# EAGLE design LRT_SHOCK_V1 (EAGLE 9.6.2)
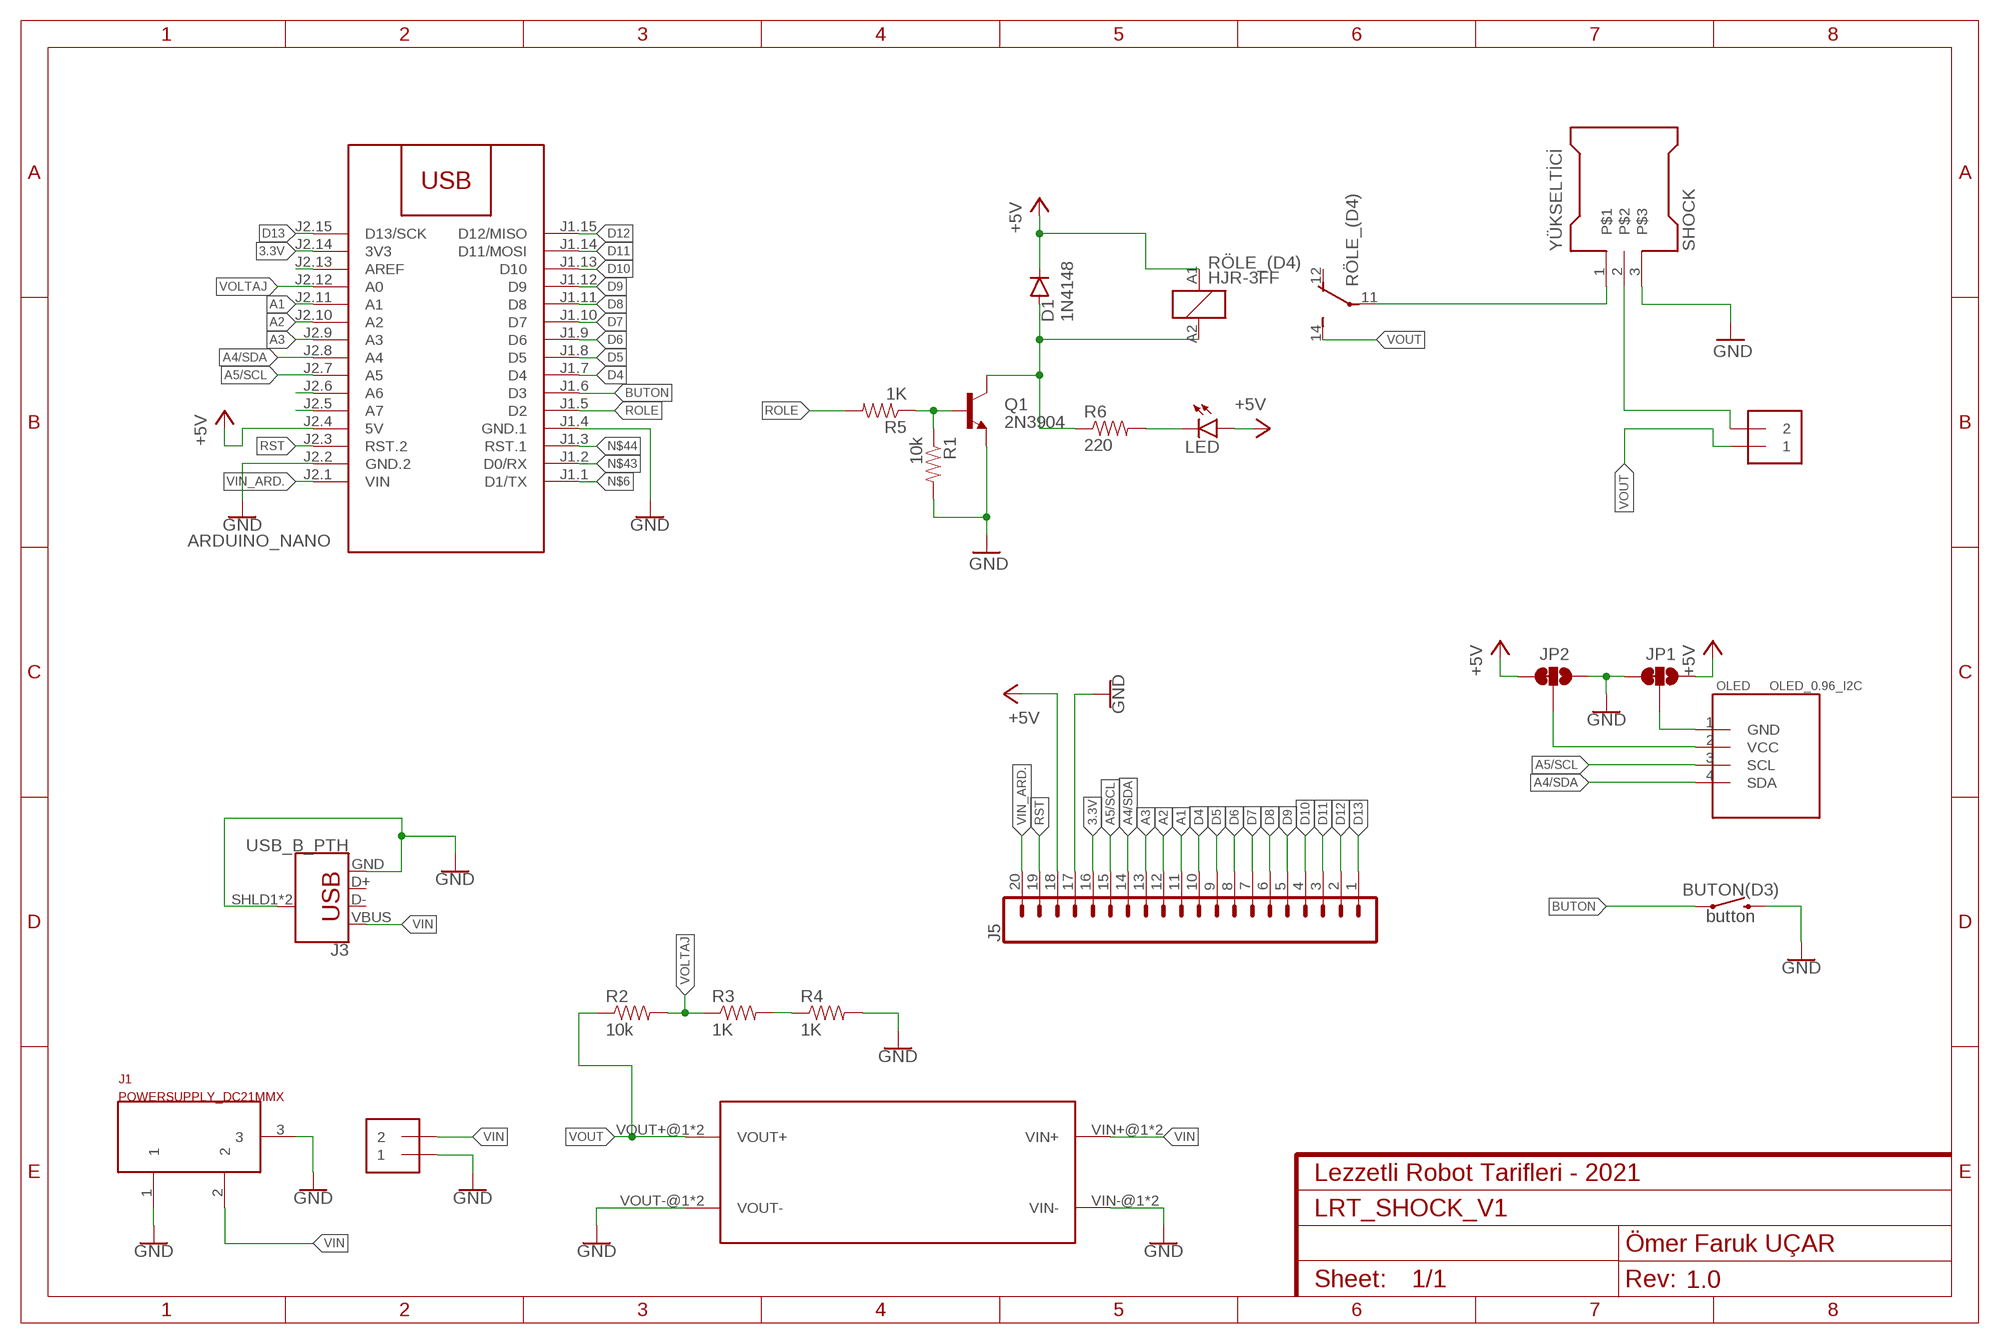
[diagram p0: schematic, sheet 1]
FRAME1 (FRAME-A4L): CNAME: Lezzetli Robot Tarifleri - 2021; CREVISION: 1.0; DESIGNER: Ömer Faruk UÇAR

## Parts
ARDUINO_NANO  ARDUINO-NANO  [ARDUINO-NANO]
BUTON(D3)  button  MOMENTARY-SWITCH-SPST-PTH-12MM  [TACTILE_SWITCH_PTH_12MM]
D1  1N4148  DIODEKIT  [DIODE-1N4148-KIT]
J1  POWERSUPPLY_DC21MMX  [POWERSUPPLY_DC-21MM]
J2  1X2-3.5MM  [1X2-3.5MM]
J3  USB_B_PTH  [USB-B-PTH]
J5  CONN_20  [1X20]
JP1  JUMPER-SMT_3_1-NC_TRACE_SILK  [SMT-JUMPER_3_1-NC_TRACE_SILK]
JP2  JUMPER-SMT_3_1-NC_TRACE_SILK  [SMT-JUMPER_3_1-NC_TRACE_SILK]
LED  LED5MM-KIT  [LED5MM-KIT]
MT3608  MT3608MT3608_2  [MT3608_2]
OLED  OLED_0.96_I2C  [OLED_0.96_I2C]
Q1  2N3904  TRANSISTOR_NPN2N3904-EZ  [TO-92-EZ]
R1  10k  1KOHM-1/4W-1%(PTH)HORIZ-KIT  [AXIAL-0.3EZ]
R2  10k  1KOHM-1/4W-1%(PTH)HORIZ-KIT  [AXIAL-0.3EZ]
R3  1K  1KOHM-1/4W-1%(PTH)HORIZ-KIT  [AXIAL-0.3EZ]
R4  1K  1KOHM-1/4W-1%(PTH)HORIZ-KIT  [AXIAL-0.3EZ]
R5  1K  1KOHM-1/4W-1%(PTH)HORIZ-KIT  [AXIAL-0.3EZ]
R6  220  1KOHM-1/4W-1%(PTH)HORIZ-KIT  [AXIAL-0.3EZ]
RÖLE_(D4)  HJR-3FF  ZNS5106  [ZN5]
SHOCK!!  1X2-3.5MM  [1X2-3.5MM]
YÜKSELTİCİ  SHOCK  [SHOCK]

## Nets
3.3V: ARDUINO_NANO.J2.14(3V3) J5.16
+5V: ARDUINO_NANO.J2.4(5V) D1.C J5.18 JP1.1 JP2.3 LED.A RÖLE_(D4).A1
A1: ARDUINO_NANO.J2.11(A1) J5.11
A2: ARDUINO_NANO.J2.10(A2) J5.12
A3: ARDUINO_NANO.J2.9(A3) J5.13
A4/SDA: ARDUINO_NANO.J2.8(A4) J5.14 OLED.4(SDA)
A5/SCL: ARDUINO_NANO.J2.7(A5) J5.15 OLED.3(SCL)
BUTON: ARDUINO_NANO.J1.6(D3) BUTON(D3).1
D4: ARDUINO_NANO.J1.7(D4) J5.10
D5: ARDUINO_NANO.J1.8(D5) J5.9
D6: ARDUINO_NANO.J1.9(D6) J5.8
D7: ARDUINO_NANO.J1.10(D7) J5.7
D8: ARDUINO_NANO.J1.11(D8) J5.6
D9: ARDUINO_NANO.J1.12(D9) J5.5
D10: ARDUINO_NANO.J1.13(D10) J5.4
D11: ARDUINO_NANO.J1.14(D11/MOSI) J5.3
D12: ARDUINO_NANO.J1.15(D12/MISO) J5.2
D13: ARDUINO_NANO.J2.15(D13/SCK) J5.1
GND: ARDUINO_NANO.J1.4(GND.1) ARDUINO_NANO.J2.2(GND.2) BUTON(D3).3 J1.1 J1.3 J2.1 J3.GND J3.SHLD1(SHIELD) J3.SHLD2(SHIELD) J5.17 JP1.3 JP2.1 MT3608.VIN-@1(VIN-) MT3608.VIN-@2(VIN-) Q1.1(E) R1.P$2 R4.P$2 YÜKSELTİCİ.3
N$1: MT3608.VOUT-@1(VOUT-) MT3608.VOUT-@2(VOUT-) ; supply symbol labelled GND
N$3: SHOCK!!.2 YÜKSELTİCİ.2
N$5: R3.P$2 R4.P$1
N$6: ARDUINO_NANO.J1.1(D1/TX)
N$10: JP1.2 OLED.1(GND)
N$14: D1.A Q1.3(C) R6.P$1 RÖLE_(D4).A2
N$15: Q1.2(B) R1.P$1 R5.P$1
N$17: LED.K(C) R6.P$2
N$18: RÖLE_(D4).11(2:P) YÜKSELTİCİ.1
N$19: JP2.2 OLED.2(VCC)
N$36: ARDUINO_NANO.J2.13(AREF)
N$40: ARDUINO_NANO.J2.6(A6)
N$41: ARDUINO_NANO.J2.5(A7)
N$43: ARDUINO_NANO.J1.2(D0/RX)
N$44: ARDUINO_NANO.J1.3(RST.1)
ROLE: ARDUINO_NANO.J1.5(D2) R5.P$2
RST: ARDUINO_NANO.J2.3(RST.2) J5.19
VIN: J1.2 J2.2 J3.VBUS MT3608.VIN+@1(VIN+) MT3608.VIN+@2(VIN+)
VIN_ARD.: ARDUINO_NANO.J2.1(VIN) J5.20
VOLTAJ: ARDUINO_NANO.J2.12(A0) R2.P$2 R3.P$1
VOUT: MT3608.VOUT+@1(VOUT+) MT3608.VOUT+@2(VOUT+) R2.P$1 RÖLE_(D4).14(2:S) SHOCK!!.1
Unconnected: J3.D+ J3.D- RÖLE_(D4).12(2:O)

## Library data of the parts
ARDUINO_NANO = OmerFaruk-CPUBoards:ARDUINO-NANO: Arduino Nano 3.0
BUTON(D3) = SparkFun-Switches:MOMENTARY-SWITCH-SPST: Momentary Switch (Pushbutton) - SPST Normally-open (NO) SPST momentary switches (buttons, pushbuttons). Variants PTH-12MM - 12mm square, through-hole Momentary Pushbutton Switch - 12mm Square <https://www.sparkfun.com/products/9190> (COM-09190) PTH-6.0MM, PTH-6.0MM-KIT - 6.0mm square, through-hole Mini Pushbutton Switch <https://www.sparkfun.com/products/97> (COM-00097) KIT package intended for soldering kit's - only one side of pads' copper is exposed. PTH-RIGHT-ANGLE-KIT - Right-angle, through-hole Right Angle Tactile Button <https://www.sparkfun.com/products/10791> - Used on SparkFun BigTime Watch Kit <https://www.sparkfun.com/products/11734> SMD-12MM - 12mm square, surface-mount Tactile Button - SMD (12mm) <https://www.sparkfun.com/products/12993> (COM-12993) Used on SparkFun PicoBoard <https://www.sparkfun.com/products/11888> SMD-4.5MM - 4.5mm Square Trackball Switch Used on SparkFun Blackberry Trackballer Breakout <https://www.sparkfun.com/products/13169> SMD-4.6MMX2.8MM - 4.60mm x 2.80mm, surface mount Used on SparkFun SAMD21 Mini Breakout <https://www.sparkfun.com/products/13664> SMD-5.2MM, SMD-5.2-REDUNDANT - 5.2mm square, surface-mount Mini Pushbutton Switch - SMD <https://www.sparkfun.com/products/8720> (COM-08720) Used on Arduino Pro Mini <https://www.sparkfun.com/products/11114> REDUNDANT package connects both switch circuits together SMD-6.0X3.5MM - 6.0 x 3.5mm, surface mount Momentary Reset Switch SMD <https://www.sparkfun.com/products/8229> (COM-08229) SMD-6.2MM-TALL - 6.2mm square, surface mount Tactile Button - SMD (6mm) <https://www.sparkfun.com/products/12992> Used on SparkFun Digital Sandbox <https://www.sparkfun.com/products/12651> SMD-RIGHT-ANGLE - Right-angle, surface mount Used on SparkFun Block for Intel® Edison - Arduino <https://www.sparkfun.com/products/13036>; PROD_ID: SWCH-09185; SF_SKU: COM-09190
D1 = SparkFun-DiscreteSemi:DIODE: Diode These are standard reverse protection diodes and small signal diodes. SMA package can handle up to about 1A. SOD-323 can handle about 200mA. What the SOD-323 package when ordering, there are some mfgs out there that are 5-pin packages.; PROD_ID: DIO-08378
J1 = SmartPrj:POWERSUPPLY_DC21MM
J2 SHOCK!! = adafruit:1X2: 3.5mm Terminal block http://www.ladyada.net/library/pcb/eaglelibrary.html
J3 = SparkFun-Connectors:USB_B: USB Type B Connector SparkFun Products: SparkFun Stepoko <https://www.sparkfun.com/products/13899> PTH; PROD_ID: CONN-08278; SF_ID: PRT-00139
J5 = SparkFun-Connectors:CONN_20: Multi connection point. Often used as Generic Header-pin footprint for 0.1 inch spaced/style header connections On any of the 0.1 inch spaced packages, you can populate with these: Break Away Headers - Straight <https://www.sparkfun.com/products/116> (PRT-00116) Break Away Male Headers - Right Angle <https://www.sparkfun.com/products/553> (PRT-00553) Female Headers <https://www.sparkfun.com/products/115> (PRT-00115) Break Away Headers - Machine Pin <https://www.sparkfun.com/products/117> (PRT-00117) Break Away Female Headers - Swiss Machine Pin <https://www.sparkfun.com/products/743> (PRT-00743) For SCREWTERMINALS and SPRING TERMINALS visit here: Screw Terimnals on SparkFun.com <https://www.sparkfun.com/search/results?term=Screw+Terminals> (5mm/3.5mm/2.54mm spacing) This device is also useful as a general connection point to wire up your design to another part of your project. Our various solder wires solder well into these plated through hole pads. Hook-Up Wire - Assortment (Stranded, 22 AWG) <https://www.sparkfun.com/products/11375> (PRT-11375) Hook-Up Wire - Assortment (Solid Core, 22 AWG) <https://www.sparkfun.com/products/11367> (PRT-11367) View the entire wire category on our website here <https://www.sparkfun.com/categories/141> Special notes: Molex polarized connector foot print use with SKU : PRT-08231 with associated crimp pins and housings. 1MM SMD Version SKU: PRT-10208 NOTES ON THE VARIANTS LOCK and LOCK_LONGPADS... This footprint was designed to help hold the alignment of a through-hole component (i.e. 6-pin header) while soldering it into place. You may notice that each hole has been shifted either up or down by 0.005 of an inch from it's more standard position (which is a perfectly straight line). This slight alteration caused the pins (the squares in the middle) to touch the edges of the holes. Because they are alternating, it causes a "brace" to hold the component in place. 0.005 has proven to be the perfect amount of "off-center" position when using our standard breakaway headers. Although looks a little odd when you look at the bare footprint, once you have a header in there, the alteration is very hard to notice. Also,if you push a header all the way into place, it is covered up entirely on the bottom side. Note about LOCK SPECIAL package: This is just like the LOCK variant in that the holes are staggared by 5 mil, but except for the last two holes. They are not altered from the "standard" footprint layout. This is used for a special purpose on the layout of our Graphic LCD Backpack. Make sure you want to use this device before selecting it for you project!
JP1 JP2 = SparkFun-Jumpers:JUMPER-SMT_3_1-NC_TRACE: Normally closed trace jumper (1 of 2 connections) This jumper has a trace between two pads so it's normally closed (NC). The other connection is normally open (NO). Use a razor knife to open the connection. For best results follow the IPC guidelines for cutting traces: Cutout at least 0.063 mm (0.005 in). Remove all loose material to clean up the cut area. Seal the cut with an approved epoxy. Reapply solder to reclose the connection, or to close the NO connection.
LED = SparkFun-LED:LED: LEDs Standard schematic elements and footprints for 5mm, 3mm, 1206, and 0603 sized LEDs. 5mm - Spark Fun Electronics SKU : COM-00529 (and others); PROD_ID: DIO-09529
MT3608 = OmerFarukUcar-PowerModules:MT3608
OLED = tft_1.8_1.44_oled_0.96:OLED_0.96_I2C
Q1 = SparkFun-DiscreteSemi:TRANSISTOR_NPN: Generic NPN BJT MMBT2222A - TRANS-08049 (SOT-23, 1A 40V) MPSA42 - TRANS-09116 (SOT-23, 500mA 300V) MMBT5088LT1G - TRANS-11160 (SOT-23, 50 mA 30V) BC547 - COM-08928 <http://www.sparkfun.com/products/8928> (TO-92 45V 100mA) (1.Collector 2.Base 3.Emitter) 2N3904 - COM-00521 <http://www.sparkfun.com/products/521> (TO-92 40V 200mA) (1.Emitter 2.Base 3.Collector) P2N2222A - COM-12852 <http://www.sparkfun.com/products/12852> (TO-92 40V 600mA) (1.Collector 2.Base 3.Emitter); PROD_ID: TRANS-08447
R1 R2 R6 = SparkFun-Resistors:1KOHM-1/4W-1%(PTH): RES-12182; PROD_ID: RES-12182; VALUE: 1K
R3-R5 = SparkFun-Resistors:1KOHM-1/4W-1%(PTH): RES-12182; PROD_ID: RES-12182
RÖLE_(D4) = relay:ZNS5*: Miniature Power PCB Relay SCHRACK 1pole 10 A Source: http://www.schrack.com/.. 5847.pdf; OC_FARNELL: unknown; OC_NEWARK: unknown
YÜKSELTİCİ = OmerFarukUcar-Test:SHOCK

## Board
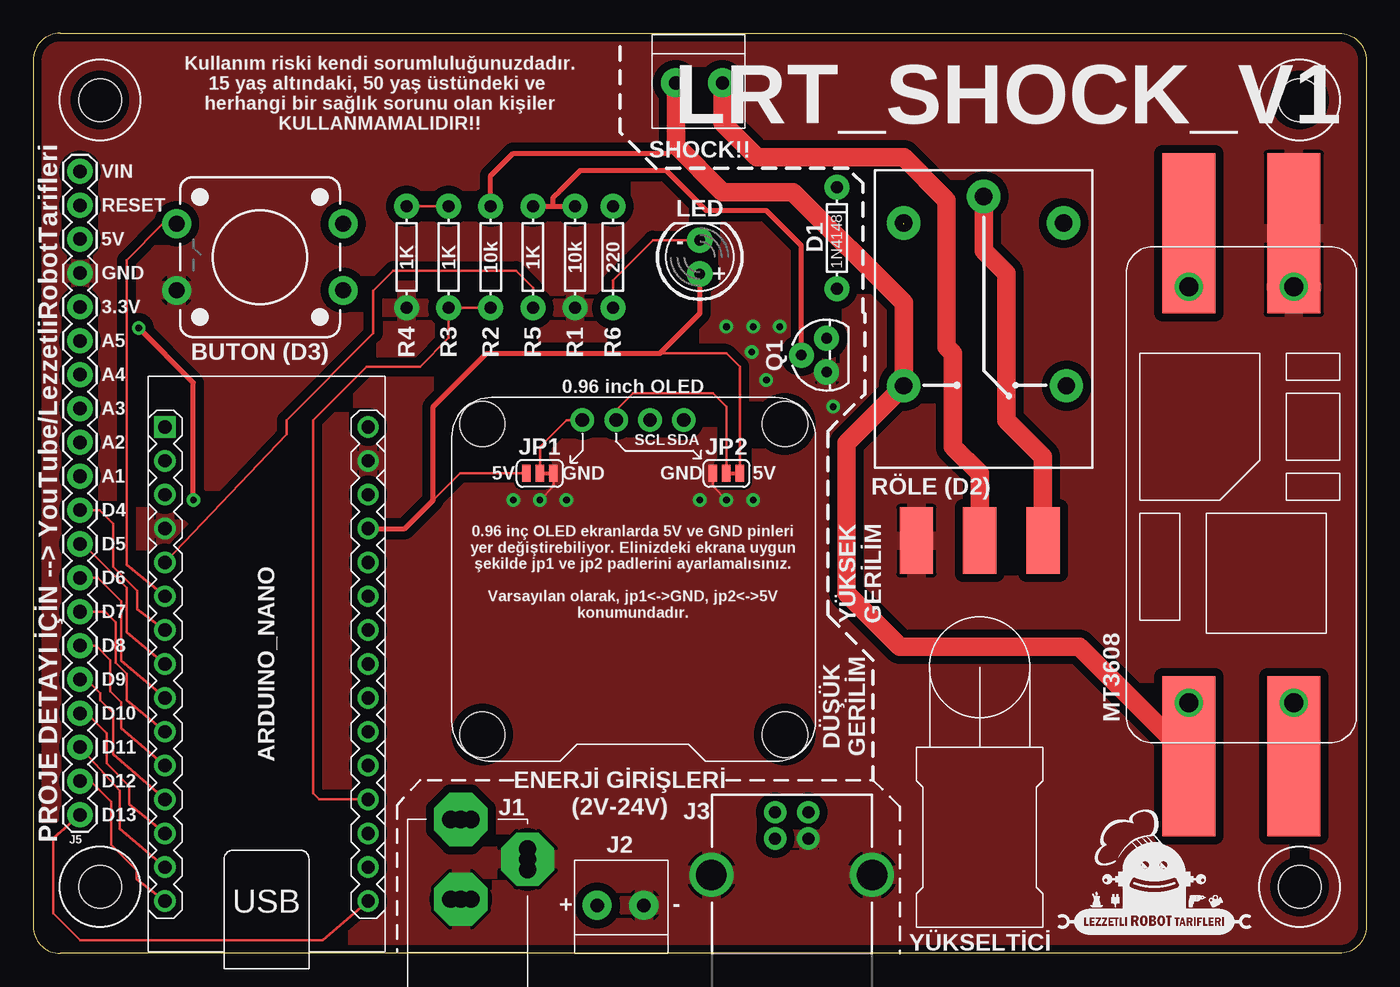
[diagram p1: board, top side]
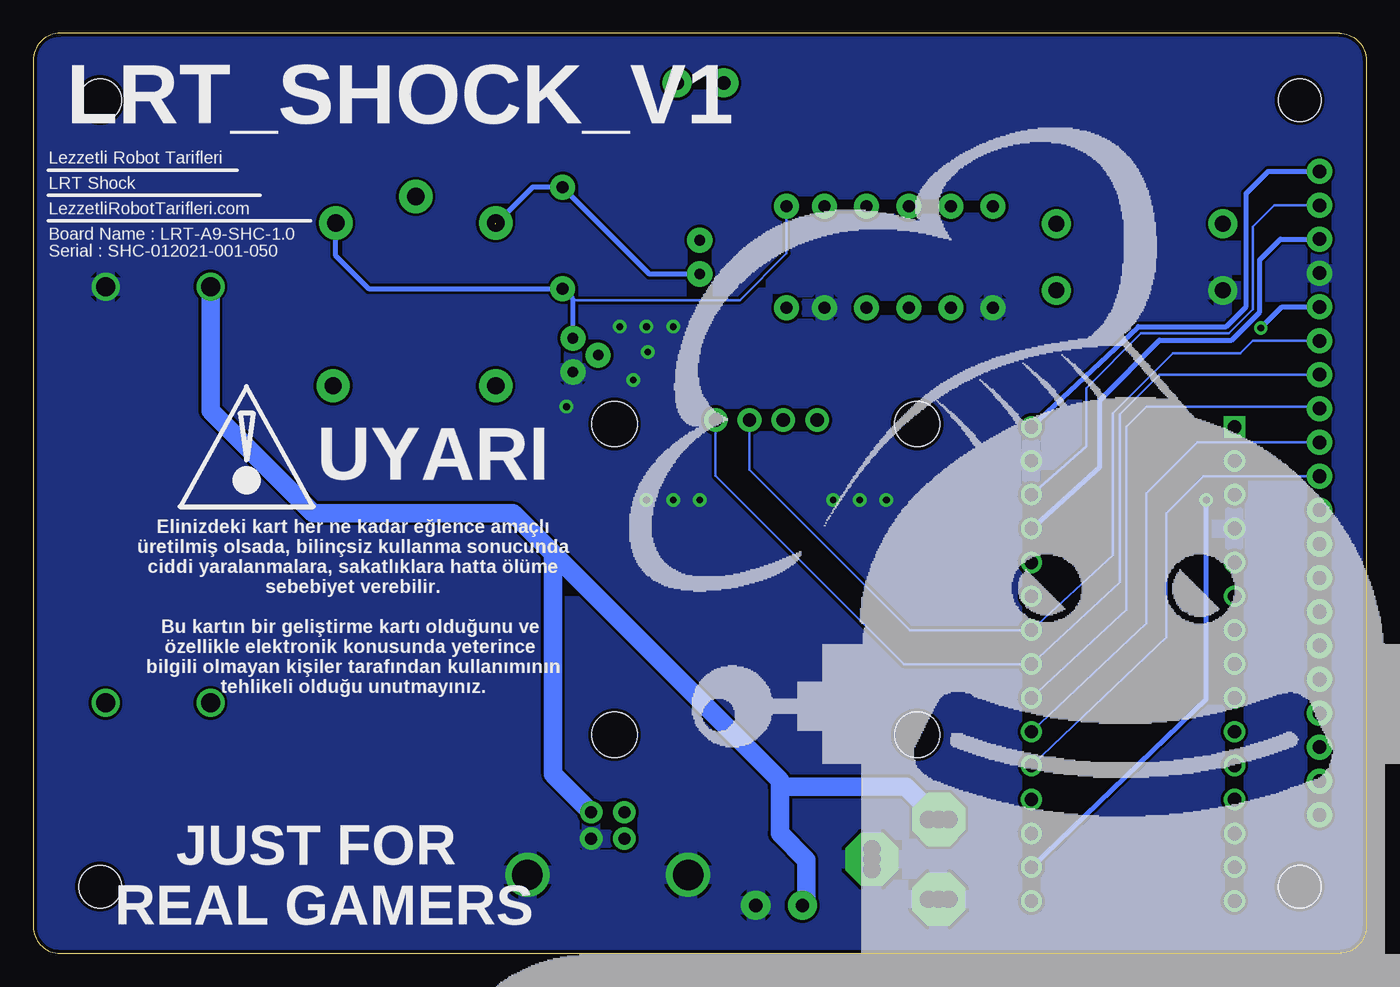
[diagram p2: board, bottom side, seen from below]

Size 100 x 69 mm. Coordinates in mm from the lower left corner, seen from the top.
Outline: 0,67 0,2 arc90 2,0 98,0 arc90 100,2 100,67 arc90 98,69 2,69 arc90 0,67
Copper layers (1*16): Top 0.035mm / dielectric 1.5mm / Bottom 0.035mm
Design rules "SparkFunOFU": minimum track width 8mil, minimum drill 12mil, track to track 8mil, track to pad 8mil, pad to pad 8mil, via to via 8mil, smd to smd 0mil, copper to edge 10mil, drill to drill 10mil, minimum pad ring 12mil, minimum via ring 10mil, stop-mask expansion 2mil, vias tented up to drill 100mil, thermal gap 10mil
Holes 3.2 mm at 5,5 5,64 95,64 95,5

### Footprints (pad centres in the part's own frame; a part is rotated, then mirrored left to right if it is on the bottom)
ARDUINO-NANO = drill 1 square: J1.1 17.78,7.62 | drill 1: J1.2 15.24,7.62; J1.3 12.7,7.62; J1.4 10.16,7.62; J1.5 7.62,7.62; J1.6 5.08,7.62; J1.7 2.54,7.62; J1.8 0,7.62; J1.9 -2.54,7.62; J1.10 -5.08,7.62; J1.11 -7.62,7.62; J1.12 -10.16,7.62; J1.13 -12.7,7.62; J1.14 -15.24,7.62; J1.15 -17.78,7.62; J2.1 17.78,-7.62; J2.2 15.24,-7.62; J2.3 12.7,-7.62; J2.4 10.16,-7.62; J2.5 7.62,-7.62; J2.6 5.08,-7.62; J2.7 2.54,-7.62; J2.8 0,-7.62; J2.9 -2.54,-7.62; J2.10 -5.08,-7.62; J2.11 -7.62,-7.62; J2.12 -10.16,-7.62; J2.13 -12.7,-7.62; J2.14 -15.24,-7.62; J2.15 -17.78,-7.62
TACTILE_SWITCH_PTH_12MM = drill 1.2 pad 2.159: 1 6.25,-2.5; 2 -6.25,-2.5; 3 6.25,2.5; 4 -6.25,2.5
DIODE-1N4148-KIT = drill 0.9 pad 1.88: A -3.81,0; C 3.81,0
POWERSUPPLY_DC-21MM = drill 1.3 pad 4 octagon: 1 -5.08,-3.353; 2 -0.076,-6.35; 3 -0.076,-0.356 | drill 1.3: 4 -5.08,-4.115; 5 -5.08,-2.591; 6 -0.838,-0.356; 7 0.686,-0.356; 8 -0.838,-6.35; 9 0.686,-6.35
1X2-3.5MM = drill 1 pad 2.184: 1 1.8,0; 2 -1.7,0
USB-B-PTH = drill 0.914 pad 1.676: D+ 4,1.25; D- 5.981,1.25; GND 4,-1.25; VBUS 5.981,-1.25 | drill 2.286: SHLD1 1.282,-6.02; SHLD2 1.282,6.02
1X20 = drill 1.016 pad 1.88: 1 0,0; 2 2.54,0; 3 5.08,0; 4 7.62,0; 5 10.16,0; 6 12.7,0; 7 15.24,0; 8 17.78,0; 9 20.32,0; 10 22.86,0; 11 25.4,0; 12 27.94,0; 13 30.48,0; 14 33.02,0; 15 35.56,0; 16 38.1,0; 17 40.64,0; 18 43.18,0; 19 45.72,0; 20 48.26,0
SMT-JUMPER_3_1-NC_TRACE_SILK = smd 0.635 x 1.27: 1 -1.016,0; 2 0,0; 3 1.016,0
LED5MM-KIT = drill 0.813 pad 1.88: A -1.27,0; K 1.27,0
MT3608_2 = drill 1.4: VIN+@1 -16,-4.301; VIN-@1 -16,3.573; VOUT+@1 15.211,-4.301; VOUT-@1 15.211,3.573 | smd 12 x 4: VIN+@2 -20,-4.301; VIN-@2 -20,3.573; VOUT+@2 19.211,-4.301; VOUT-@2 19.211,3.573
OLED_0.96_I2C = drill 1 pad 1.778: 1 -3.81,12; 2 -1.27,12; 3 1.27,12; 4 3.81,12 | hole 3.4: -11.31,-11.6; 11.39,-11.6; 11.39,11.7; -11.31,11.7
TO-92-EZ = drill 0.813 pad 1.88: 1 -1.27,0; 2 0,1.905; 3 1.27,0
AXIAL-0.3EZ = drill 0.9 pad 1.88: P$1 -3.81,0; P$2 3.81,0
ZN5 = drill 1.3 pad 2.5: 11 8.89,0; 12 -5.31,-6.2; 14 -5.31,6; A1 6.89,6; A2 6.89,-6
SHOCK = smd 5 x 2.5: 1 29,0; 2 29,4.75; 3 29,9.5

### Placement (x,y rotation side)
ARDUINO_NANO  17.5,21.7 90 top
BUTON(D3)  17,52.22 180 top
D1  60.29,53.66 90 top
J1  32,3.7 180 top
J2  44,3.6 0 top
J3  56.9,4.6 90 top
J5  3.5,10.38 90 top
JP1  38,36 0 top
JP2  52,36 0 top
LED  50,52.22 90 top
MT3608  91,34 270 top
OLED  45,28 0 top
Q1  59.52,44.87 90 top
R1  40.64,52.22 270 top
R2  34.32,52.22 270 top
R3  31.16,52.22 90 top
R4  28,52.22 270 top
R5  37.48,52.22 270 top
R6  43.48,52.22 270 top
RÖLE_(D4)  71.31,47.88 90 top
SHOCK!!  50,65.28 180 top
U$3  [LRT-LOGO-0,0125-B]  83.98,0.89 0 top
U$4  [LRT-LOGO-0,10416-B-N_I]  20.74,-19.07 0 bottom  (outside the outline)
YÜKSELTİCİ  75.76,1.95 90 top

### Tracks (layer width: path | path; a pad name or v marks a point on that pad's centre or on a via)
3.3V  (via drill 0.5)
  Top 0.391: v12,34 12,42.81 v7.9,46.9
  Bottom 0.391: ARDUINO_NANO.J2.14 12,19.08 v12,34 | v7.9,46.9 6.33,48.48 J5.16
+5V  (1 unrouted)
  Top 0.203: JP2.3 53.02,36.25 53,36.27 53,44 52,45 47,45 | JP1.1 32,36 30,34
  Top 0.391: ARDUINO_NANO.J2.4 27.86,31.86 30,34 30,41 34,45 47,45 50,48 LED.A
  Bottom 0.391: LED.A 53.77,50.95 D1.C 62.53,57.47 65.31,54.69 | ARDUINO_NANO.J2.4 20,36.48 20,41.5 15.5,46 10.09,46 8,48.09 8,52 6.44,53.56 J5.18
A1
  Bottom 0.203: ARDUINO_NANO.J2.11 15,23.7 15,33 12.22,35.78 J5.11
A2
  Bottom 0.203: ARDUINO_NANO.J2.10 16.5,24.74 16.5,34.5 12.68,38.32 J5.12
A3
  Bottom 0.203: ARDUINO_NANO.J2.9 18,25.78 18,39.5 16.5,41 3.37,41 J5.13
A4/SDA
  Bottom 0.203: OLED.4 48.81,35.81 34.7,21.7 ARDUINO_NANO.J2.8 18.5,27.82 18.5,40.42 15.53,43.4 J5.14
A5/SCL
  Bottom 0.203: OLED.3 46.27,36.27 34.24,24.24 ARDUINO_NANO.J2.7 19,29.86 19,40.5 14.5,45 9.44,45 8.5,45.94 J5.15
BUTON
  Top 0.203: BUTON(D3).1 9.72,54.72 7,52 7,29.16 ARDUINO_NANO.J1.6
D4
  Top 0.203: ARDUINO_NANO.J1.7 7.81,25.81 7.81,27.19 6,29 6,32.21 4.97,33.24 J5.10
D5
  Top 0.203: ARDUINO_NANO.J1.8 7,24.08 7,27.43 3.73,30.7 J5.9
D6
  Top 0.203: J5.8 4.84,28.16 6.59,26.41 6.59,21.95 ARDUINO_NANO.J1.9
D7
  Top 0.203: ARDUINO_NANO.J1.10 7,19 7,20.96 6.19,21.78 6.19,24.81 5.38,25.62 J5.7
D8
  Top 0.203: ARDUINO_NANO.J1.11 6.59,16.87 6.59,18.83 5.78,19.64 5.78,22 4.7,23.08 J5.6
D9
  Top 0.203: J5.5 3.96,20.54 5,19.5 5,19 6,18 6,14.92 ARDUINO_NANO.J1.12
D10
  Top 0.203: ARDUINO_NANO.J1.13 7.19,11.19 7.19,12.55 5.5,14.24 5.5,16.5 4,18 J5.4
D11
  Top 0.203: J5.3 6.48,12.21 6.48,9.36 ARDUINO_NANO.J1.14
D12
  Top 0.203: ARDUINO_NANO.J1.15 7.75,5.55 7.75,6.25 5.86,8.14 5.86,11.36 4.3,12.92 J5.2
D13
  Top 0.203: ARDUINO_NANO.J2.15 21.7,1 3.5,1 1.5,3 1.5,8.65 J5.1
GND  (via drill 0.5)
  Top 0.203: JP1.3 39.02,35.02 v38,34 | JP2.1 50.98,35.02 v52,34
  other vias: 52,47 54,47 56,47 53.9,45.1 55,43 60,41 54,34 50,34 40,34 36,34
  pour Top (isolate 0.61): -5,64 -5,9 -5,-5 100,-5 105,-5 105,69 105,74 -5,74
  pour Bottom (hatched): -5,74 -5,-5 105,-5 105,74
N$1
  Top 1.38: MT3608.VOUT-@2 MT3608.VOUT-@1
N$3
  Top 1.38: YÜKSELTİCİ.2 71.01,35.99 69,38 69,45 68.5,45.5 68.5,56.5 65.3,59.7 54.3,59.7 51.7,62.3 SHOCK!!.2
N$5
  Top 0.203: R4.P$1 R3.P$2
N$10
  Top 0.203: JP1.2 38,38 40,40 OLED.1
N$14
  Bottom 0.203: 60.22,49.78 59.44,49 47,49 43.48,52.52 R6.P$1
  Bottom 0.391: Q1.3 59.52,49.08 60.22,49.78 D1.A 74.85,49.85 77.31,52.31 RÖLE_(D4).A2
N$15
  Top 0.391: Q1.2 57.62,53.09 55,55.7 50.5,55.7 47.5,58.7 41,58.7 39.65,57.35 39.5,57.2 39,56.7 39,56.03 | R5.P$1 39,56.03 | 39,56.03 R1.P$1
N$17
  Top 0.203: LED.K 46.49,53.49 43.48,50.48 R6.P$2
N$18
  Top 1.38: YÜKSELTİCİ.1 75.76,37.24 73,40 73,51 71.31,52.69 RÖLE_(D4).11
N$19
  Top 0.203: JP2.2 52,40 52,41 51,42 50,42 45,42 43.73,40.73 OLED.2
ROLE
  Top 0.203: R5.P$2 37.48,49.92 36.2,51.2 27,51.2 25.5,49.7 25.5,46.5 19,40 19,38.94 ARDUINO_NANO.J1.5
RST
  Bottom 0.203: ARDUINO_NANO.J2.3 21,38.02 21,42.39 16.89,46.5 10.29,46.5 8.5,48.29 8.5,54.5 6.9,56.1 J5.19
VIN
  Top 1.38: MT3608.VIN+@2 MT3608.VIN+@1
  Bottom 1.38: J1.2 34.53,12.5 44,12.5 | MT3608.VIN+@1 86.7,40.7 79,33 64,33 61,30 | 61,30 44,13 44,12.5 | J2.2 42,3.9 42,7 44,9 44,12.5 | 59.03,11.46 J3.VBUS 61,13.43 61,30
VIN_ARD.
  Bottom 0.391: ARDUINO_NANO.J2.1 17.1,47 10.5,47 9,48.5 9,57 7.36,58.64 J5.20
VOLTAJ
  Top 0.203: ARDUINO_NANO.J2.12 21.46,11.54 21,12 21,40 25,44 29,44 31.16,46.16 R3.P$1 R2.P$2
VOUT
  Top 0.391: 48.2,60.6 47.6,60 36,60 34.32,58.32 R2.P$1
  Top 1.38: SHOCK!!.1 48.2,60.6 51.7,57.1 57,57.1 65.31,48.78 RÖLE_(D4).14 61,38.26 61,27 65,23 78.49,23 MT3608.VOUT+@2 MT3608.VOUT+@1

### Text on the board
tPlace: Kullanım riski kendi sorumluluğunuzdadır. / 15 yaş altındaki, 50 yaş üstündeki ve / herhangi bir sağlık sorunu olan kişiler / KULLANMAMALIDIR!! | LRT_SHOCK_V1 | VIN | RESET | 5V | - | GND | + | 3.3V | A5 | BUTON (D3) | A4 | 0.96 inch OLED | A3 | A2 | SCL | SDA | A1 | 5V | GND | GND | 5V | RÖLE (D2) | PROJE DETAYI İÇİN --> YouTube/LezzetliRobotTarifleri | D4 | D5 | D6 | 0.96 inç OLED ekranlarda 5V ve GND pinleri / yer değiştirebiliyor. Elinizdeki ekrana uygun / şekilde jp1 ve jp2 padlerini ayarlamalısınız. / / Varsayılan olarak, jp1<->GND, jp2<->5V / konumundadır. | YÜKSEK / GERİLİM | D7 | D8 | D9 | DÜŞÜK / GERİLİM | D10 | D11 | D12 | ENERJİ GİRİŞLERİ | (2V-24V) | D13 | + | -
bPlace: LRT_SHOCK_V1 | Lezzetli Robot Tarifleri | LRT Shock | LezzetliRobotTarifleri.com | Board Name : LRT-A9-SHC-1.0 | Serial : SHC-012021-001-050 | UYARI | Elinizdeki kart her ne kadar eğlence amaçlı / üretilmiş olsada, bilinçsiz kullanma sonucunda / ciddi yaralanmalara, sakatlıklara hatta ölüme / sebebiyet verebilir. / / Bu kartın bir geliştirme kartı olduğunu ve / özellikle elektronik konusunda yeterince / bilgili olmayan kişiler tarafından kullanımının / tehlikeli olduğu unutmayınız. | JUST FOR / REAL GAMERS
Document: 5a = 1.38mm | 1a =0,150mm | 2a =0,391mm